# EasyEDA schematic Schematic_WT-03_v.1.0.json
TITLE: Schematic; REV: 1.0; Date: 2019-03-23; Sheet: 1/1; Drawn By: painkiller359; Company: eHomeDIY
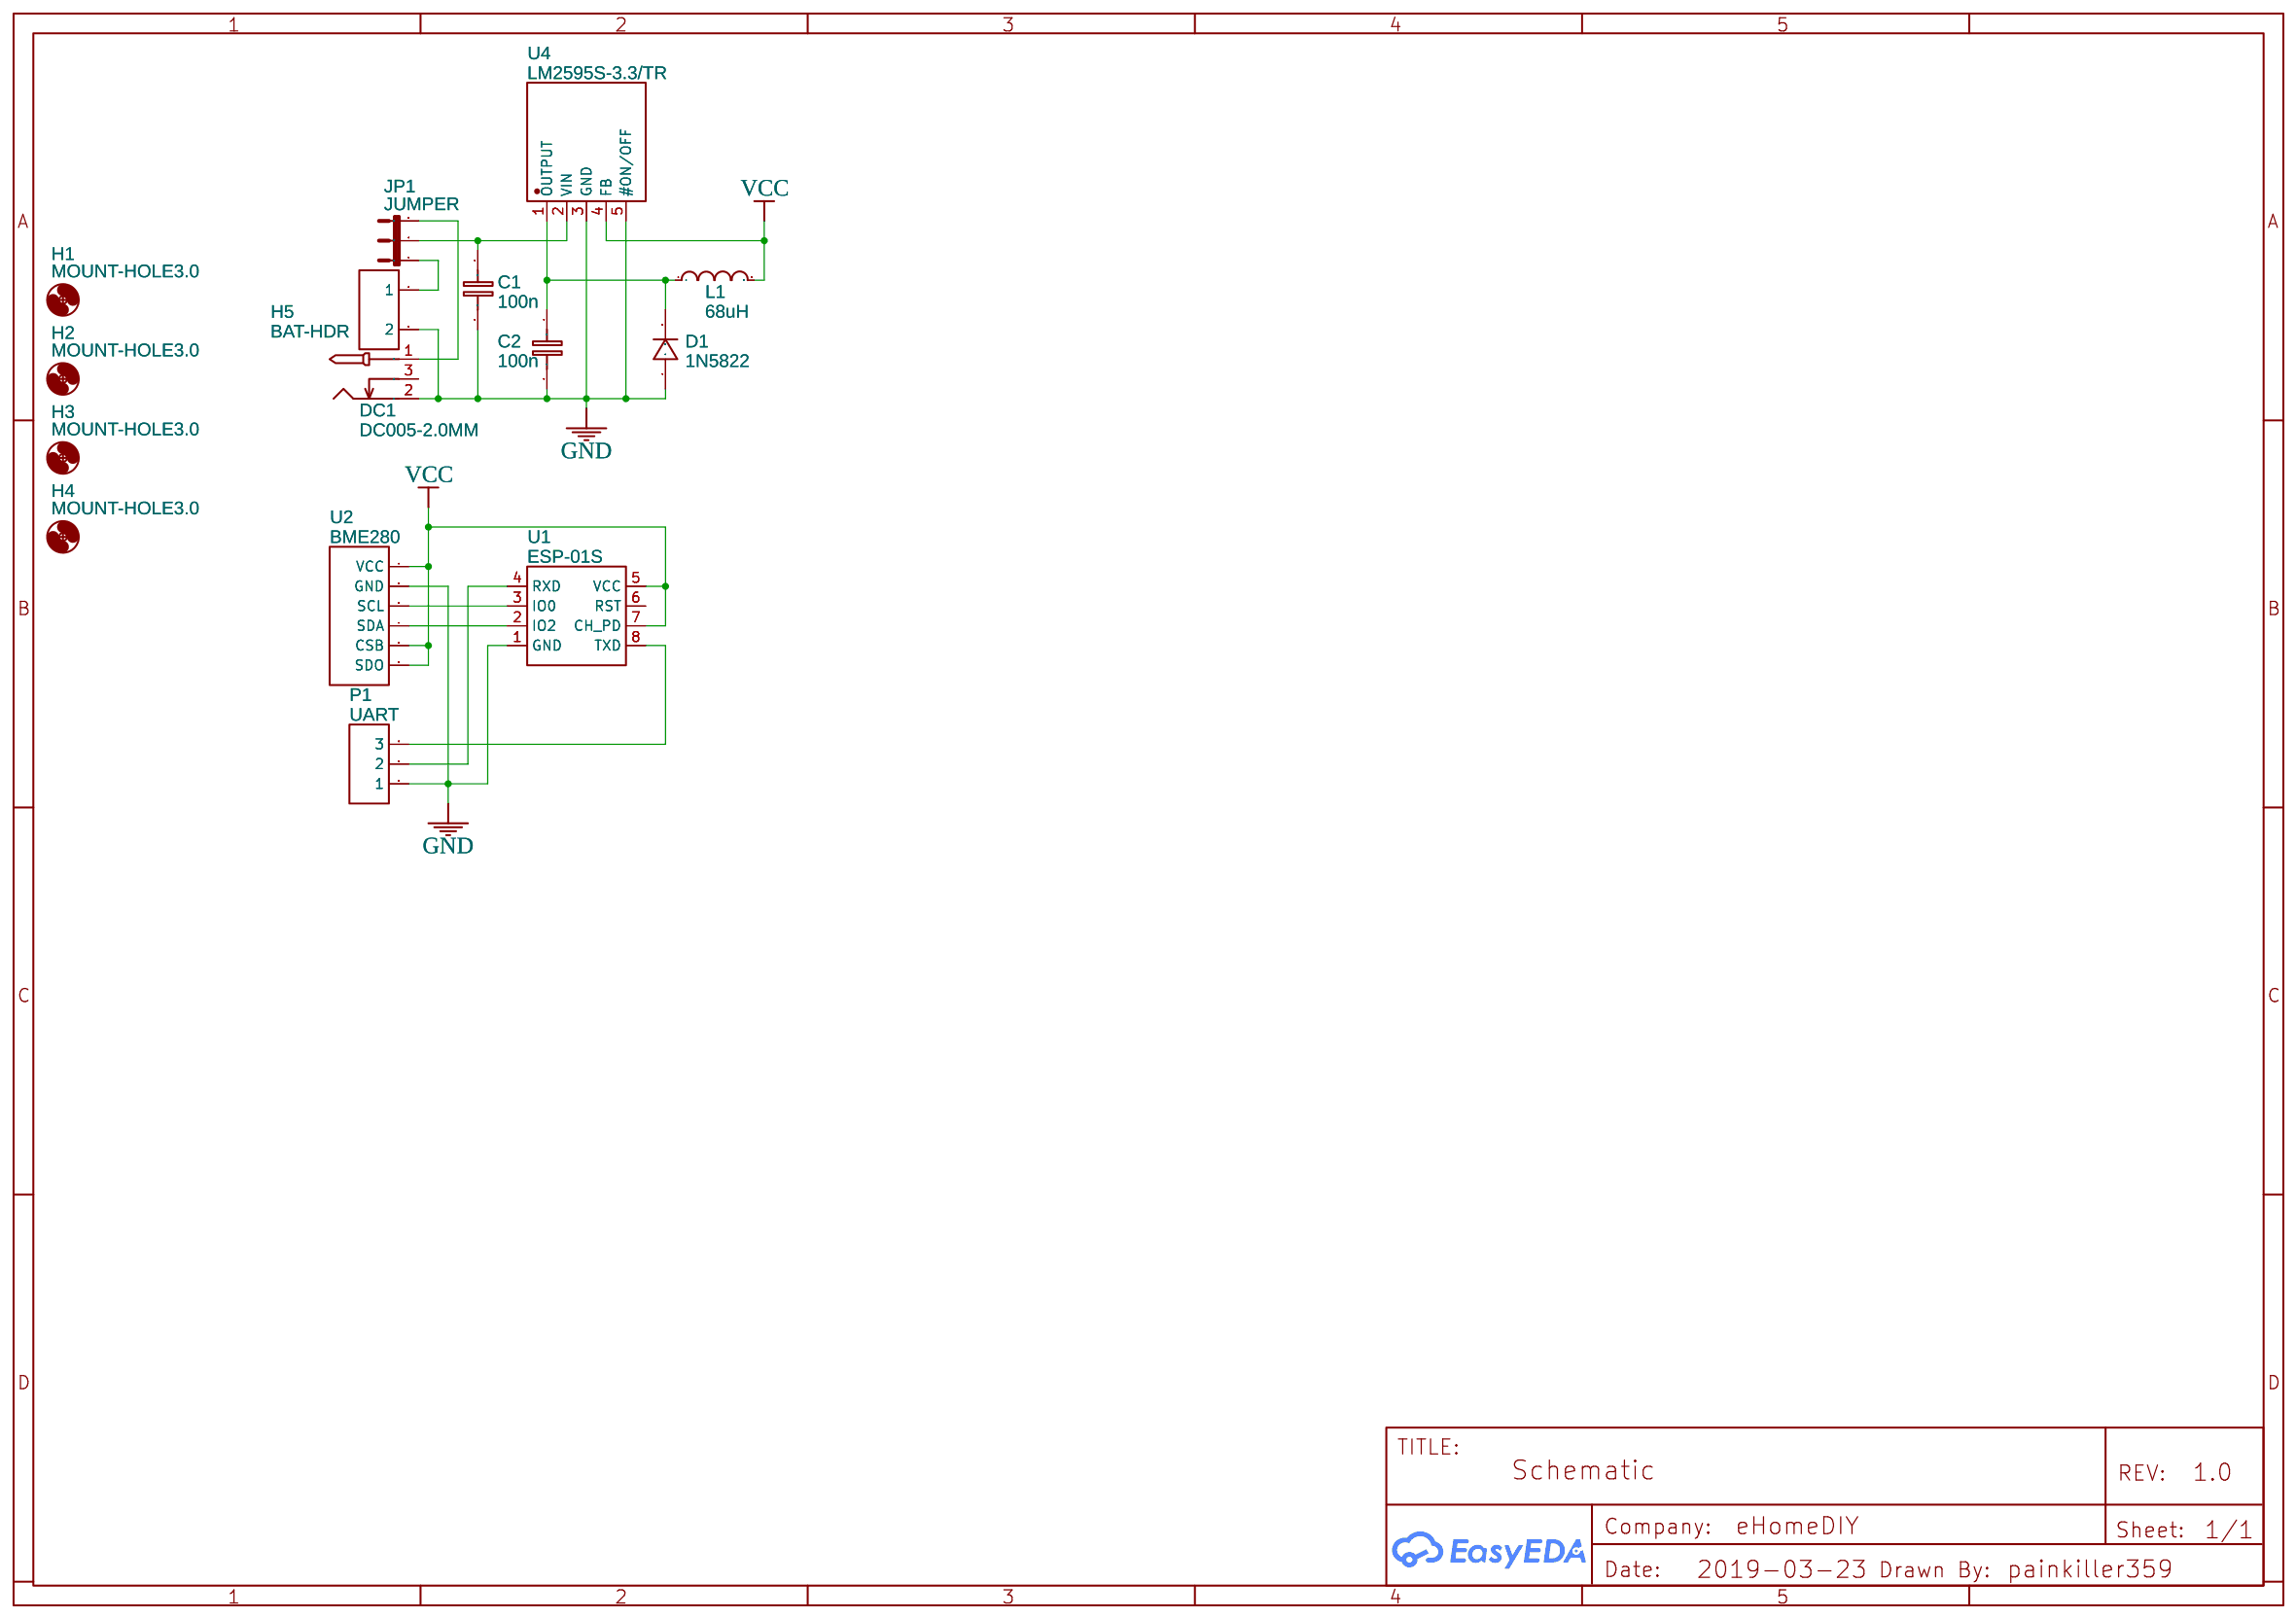
[diagram p0: schematic sheet]

## Parts
C1  100n  [RAD-0.2]
C2  100n  [RAD-0.2]
D1  1N5822  [DO-201AD]
DC1  DC005-2.0MM  [DC-5020]
H1  MOUNT-HOLE3.0  [3MMHOLE_PTH]
H2  MOUNT-HOLE3.0  [3MMHOLE_PTH]
H3  MOUNT-HOLE3.0  [3MMHOLE_PTH]
H4  MOUNT-HOLE3.0  [3MMHOLE_PTH]
H5  BAT-HDR  [HDR-2X1/2.54]
JP1  JUMPER  [1X03]
L1  68uH  [CAP-10*12]
P1  UART  [HDR-3X1/2.54]
U1  ESP-01S  [ESP-01S]
U2  BME280  [HDR-6X1/2.54]
U4  LM2595S-3.3/TR  [TO-263-5LEAD]

## Library data of the parts
C1 C2 = Cap_RAD-0.1_EU: Manufacturer Part: ?
D1 = -: Supplier Part: C169161; Supplier: LCSC; Manufacturer: DIOFIT; Contributor: LCSC
DC1 = -: Supplier: LCSC; Manufacturer: SOFNG; Supplier Part: C111567
H1-H4 = -: MOUNTING HOLE with drill center marker; Manufacturer Part: ?
H5 = -: Supplier: LCSC; Manufacturer: TE Connectivity; Manufacturer Part: 826629-2; image: //image.lceda.cn/szlcsc/C86471.jpg; Supplier Part: C86471
JP1 = -: Contributor: SparkFun; Manufacturer Part: ?
L1 = VLU1012-680KB: Supplier: LCSC; Manufacturer: FH; Contributor: LCSC; Supplier Part: C142465
P1 = -: Supplier: LCSC; Manufacturer: BOOMELE; Manufacturer Part: Header2.54mm 1*3P; image: //image.lceda.cn/szlcsc/C49257.jpg; Supplier Part: C49257
U1 = -: Supplier: LCSC; Manufacturer: Ai-Thinker; Supplier Part: C111009
U2 = -: Supplier Part: GY-BME280; Manufacturer Part: ?
U4 = -: Supplier: LCSC; Supplier Part: C316688; Manufacturer: HGSEMI; Contributor: LCSC

## Nets
GND: C1.2 C2.2 D1.1 DC1.2 H5.2 P1.1 U1.1(GND) U2.2(GND) U4.3(GND) U4.5(#ON/OFF)
VCC: L1.2 U1.5(VCC) U1.7(CH_PD) U2.1(VCC) U2.5(CSB) U2.6(SDO) U4.4(FB)
Net-(C1-1): C1.1 JP1.2 U4.2(VIN)
Net-(C2-1): C2.1 D1.2 L1.1 U4.1(OUTPUT)
Net-(DC1-1): DC1.1 JP1.3
Net-(H5-1): H5.1 JP1.1
Net-(P1-2): P1.2 U1.4(RXD)
Net-(P1-3): P1.3 U1.8(TXD)
Net-(U1-2): U1.2(IO2) U2.4(SDA)
Net-(U1-3): U1.3(IO0) U2.3(SCL)

Not connected (* = marked no-connect by the designer): DC1 3; U1 6(RST)
